# Altium schematic sheet LV.SchDoc
size A
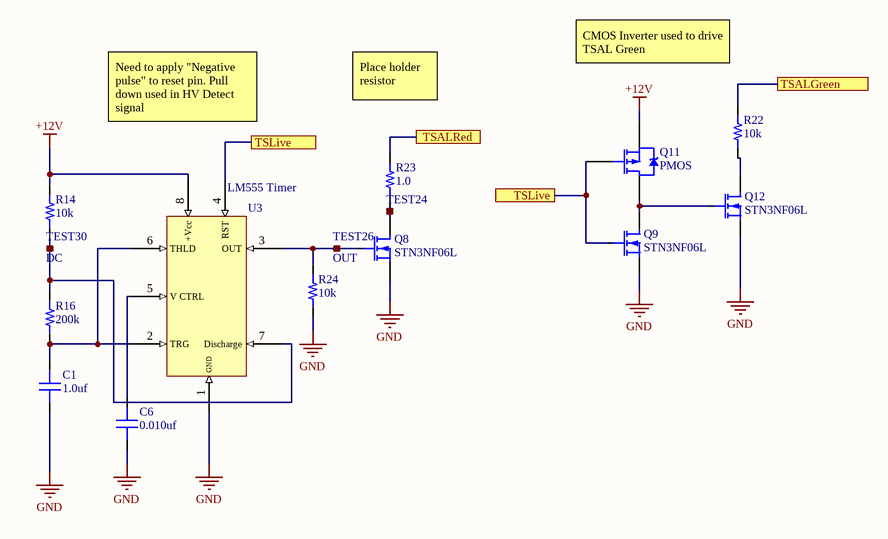
[diagram p0: LV.SchDoc]

## Parts
C1  value 1.0uf  [CAP 0603/1608]  (hidden comment: Capacitor MLCC 1.0uf 16V CAP 0603/1608)
C6  value 0.010uf  [CAP 0402/1005]  (hidden comment: Capacitor MLCC 0.010uf 16V CAP 0402/1005)
Q8  STN3NF06L  [STN3NF06L]
Q9  STN3NF06L  [STN3NF06L]
Q11  PMOS  [SOT-23 (TO-236)]
Q12  STN3NF06L  [STN3NF06L]
R14  value 10k  [RES 0402/1005]  (hidden comment: Resistor 1.1 0402 1/10W 1%)
R16  value 200k  [RES 0603/1608]  (hidden comment: Resistor 200k 0603 1/10W 1%)
R22  value 10k  [RES 0402/1005]  (hidden comment: Resistor 10k 0402 1/10W 1%)
R23  value 1.0  [RES 0603/1608]  (hidden comment: Resistor 1.0 0603 1/10W 1%)
R24  value 10k  [RES 0402/1005]  (hidden comment: Resistor 10k 0402 1/10W 1%)
TEST24  (no value)  [RCU-0C]
TEST26  OUT  [RCU-0C]
TEST30  DC  [RCU-0C]
U3  LM555 Timer  [SOIC-8]

## Ports
TSALGreen, TSALRed, TSLive

## Nets
+12V: Q11.2(S) R14.2 U3.8(+Vcc)
GND: C1.1 C6.1 Q8.3(S) Q9.3(S) Q12.3(S) R24.1 U3.1(GND)
TSALGreen: R22.2 ; port TSALGreen
TSALRed: R23.2 ; port TSALRed
TSLive: Q9.1(G) Q11.1(G) U3.4(RST) ; port TSLive
NetC1_2: C1.2 R16.1 U3.2(TRG) U3.6(THLD)
NetC6_2: C6.2 U3.5(V_CTRL)
NetQ8_1: Q8.1(G) R24.2 TEST26.1 U3.3(OUT)
NetQ8_2: Q8.2(D) R23.1 TEST24.1
NetQ9_2: Q9.2(D) Q11.3(D) Q12.1(G)
NetQ12_2: Q12.2(D) R22.1
NetR14_1: R14.1 R16.2 TEST30.1 U3.7(Discharge)

## Notes on the sheet
- (near R22) CMOS Inverter used to drive TSAL Green
- Need to apply "Negative pulse" to reset pin. Pull down used in HV Detect signal
- Place holder resistor

## Library data of the parts
C1 = 229: Manufacturer_id: 1; idCapacitor: 229; Name: Cap_1.0uf_16V_CAP 0603/1608; Dielectric: Ceramic; Created_By: Nick Mah; Drawer_id: 1; Voltage_Rating: 16V; Package: CAP 0603/1608; Created_Date: 10/20/2018
C6 = 97: Manufacturer_id: 1; idCapacitor: 97; Name: Cap_0.010uf_16V_CAP 0402/1005; Dielectric: Ceramic; Created_By: Nick Mah; Drawer_id: 1; Voltage_Rating: 16V; Package: CAP 0402/1005; Created_Date: 10/20/2018
Q8 Q9 Q12 = 8: MOSFET N-CH 60V 4A SOT223; Manufacturer_id: 1; idFETs: 8; Value: N_Channel; Rds_On: 70m; Vgs(Max): +/- 16V; Power(Max): 3.3W; Created_By: Graydon; Drawer_id: 1; Name: STN3NF06L; Vdss: 60V; Num_Circuits: 1; Id: 4A; Package: SOT-233; MfrPartNo: STN3NF06L; Link: https://www.digikey.com/product-detail/en/stmicroelectronics/STN3NF06L/497-3177-1-ND/654516; ComponentLink1Description: Datasheet; ComponentLink1URL: https://www.st.com/content/ccc/resource/technical/document/datasheet/b1/52/93/f0/a9/a9/40/d7/CD00002430.pdf/files/CD00002430.pdf/jcr:content/translations/en.CD00002430.pdf; Supplier1: Digkey; Supplier1PartNo: 497-3177-1-ND; Created_Date: 11/26/2018
Q11 = 12: P-Channel 60V 170mA (Ta) 360mW (Ta) Surface Mount SOT-23-3; Manufacturer_id: 1; idFuse: 3; idFETs: 12; Value: P_Channel; Rds_On: 8 Ohm; Vgs(typ): 2V; Vgs(Max): 20V; Power(Max): 350mW; Created_By: Angel; Drawer_id: 1; Name: BSS84PH6327XTSA2; Vdss: 60V; Num_Circuits: 1; Id: 170mA; Package: SOT-23-3; MfrPartNo: BSS84PH6327XTSA2; Link: https://www.digikey.com/product-detail/en/infineon-technologies/BSS84PH6327XTSA2/BSS84PH6327XTSA2DKR-ND/5413783; Supplier1: Digi-Key; Supplier1PartNo: BSS84PH6327XTSA2DKR-ND
R14 = 2: Manufacturer_id: 1; idResistor: 2; Name: Res_1.1_0402_1/10W_1%; Created_By: Nick Mah; Supplier 1: Digi-Key; Drawer_id: 1; Tolerance: 1%; Power: 1/10W; Package: 0402; ComponentLink1Description: Datasheet; Created_Date: 2018-10-20
R16 = 344: Manufacturer_id: 1; idResistor: 344; Name: Res_200k_0603_1/10W_1%; Created_By: Nick Mah; Supplier 1: Digi-Key; Drawer_id: 1; Tolerance: 1%; Power: 1/10W; Package: 0603; ComponentLink1Description: Datasheet; Created_Date: 2018-10-20
R22 R24 = 97: Manufacturer_id: 1; idResistor: 97; Name: Res_10k_0402_1/10W_1%; Created_By: Nick Mah; Supplier 1: Digi-Key; Drawer_id: 1; Tolerance: 1%; Power: 1/10W; Package: 0402; ComponentLink1Description: Datasheet; Created_Date: 2018-10-20
R23 = 217: Manufacturer_id: 1; idResistor: 217; Name: Res_1.0_0603_1/10W_1%; Created_By: Nick Mah; Supplier 1: Digi-Key; Drawer_id: 1; Tolerance: 1%; Power: 1/10W; Package: 0603; ComponentLink1Description: Datasheet; Created_Date: 2018-10-20
TEST24 TEST26 TEST30 = 14: Test point; Manufacturer_id: 1; idConn: 14; Value: CONN; Created_By: Graydon; Updated_By: Null; Drawer_id: 1; Name: RCU-0C; Num_Contacts: 1; Num_Rows: 1; Package: RCU-0C; MfrPartNo: RCU-0C; Link: https://www.digikey.com/product-detail/en/te-connectivity-amp-connectors/RCU-0C/A106145CT-ND/3477802; ComponentLink1Description: Null; ComponentLink1URL: Null; Supplier1: None; Supplier1PartNo: None; Created_Date: 11/10/2018
U3 = 17: Manufacturer_id: 1; idIC_Misc: 17; Drawer_id: 1; Name: LM555 Timer